# Altium schematic sheet 12V_Supply.SchDoc
size 297 x 209 mm; SheetNumber: 8; SheetTotal: 11
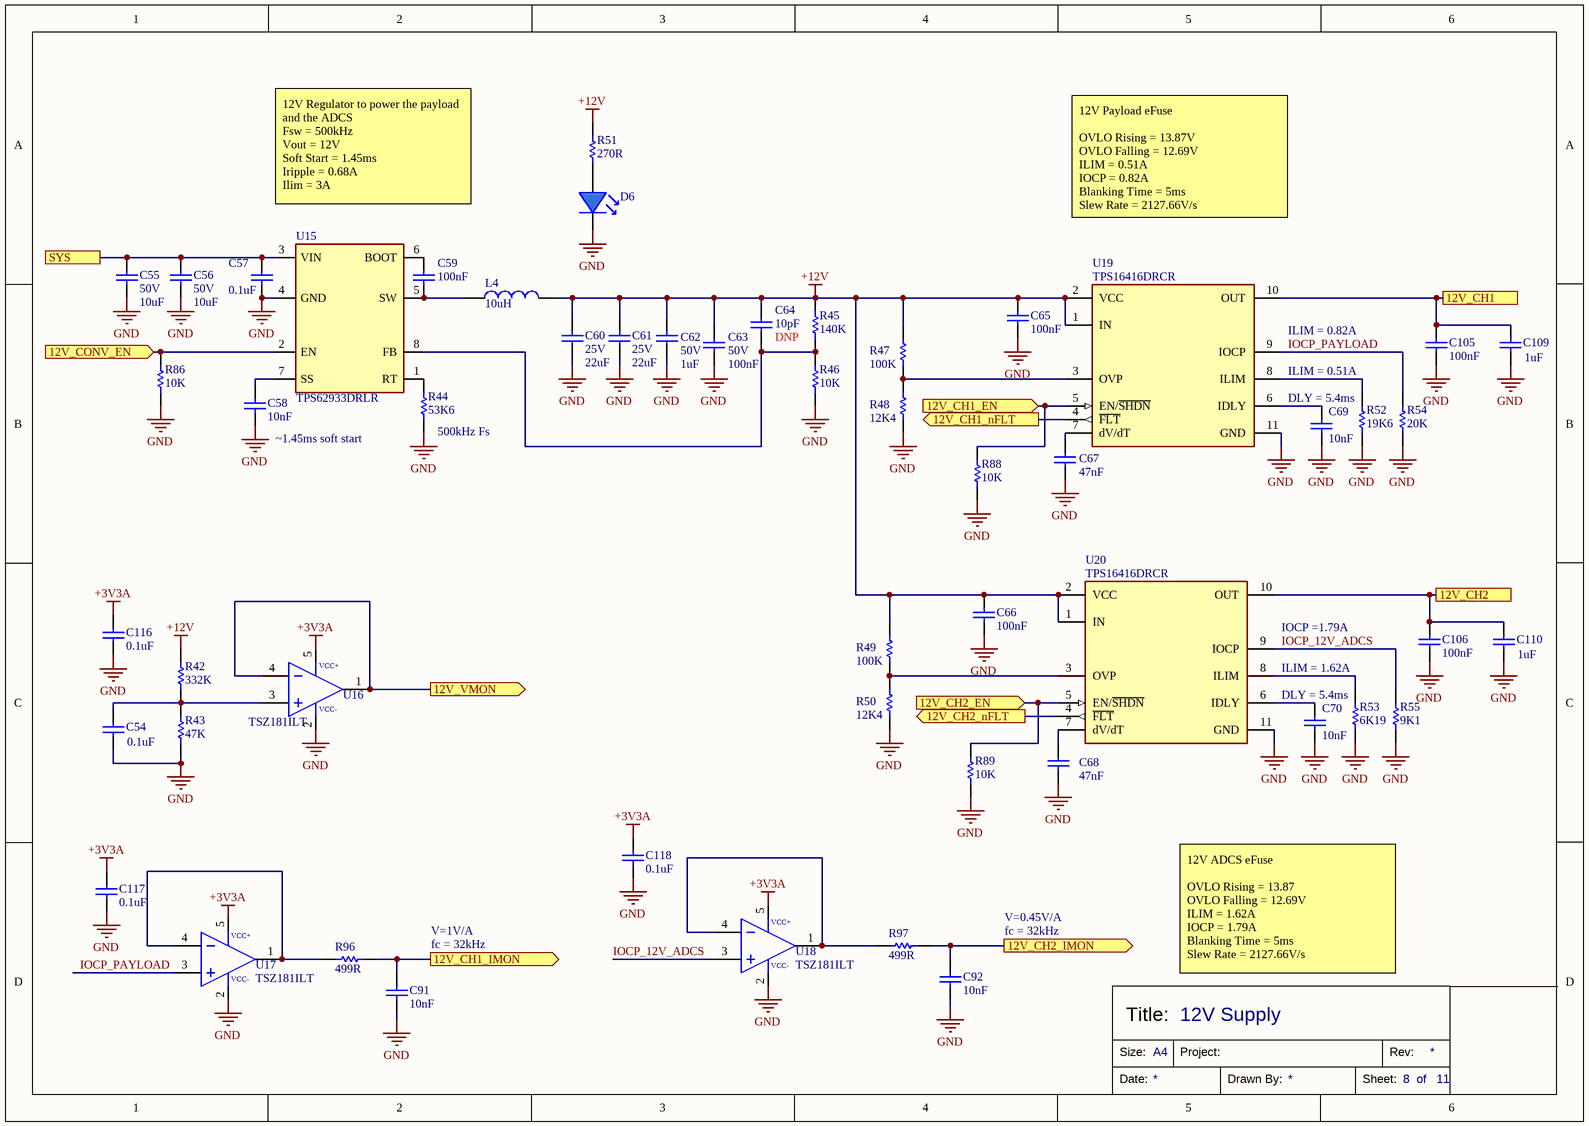
[diagram p0: 12V_Supply.SchDoc]

## Parts
C54  Capacitance: 0.1uF  [CAPC0805X060]  (hidden comment: CL21B104KACNNNC)
C55  Voltage Rating: 50V  Capacitance: 10uF  [CAPC1210X090]  (hidden comment: CL32B106KBJNNNE)
C56  Voltage Rating: 50V  Capacitance: 10uF  [CAPC1210X090]  (hidden comment: CL32B106KBJNNNE)
C57  Capacitance: 0.1uF  [CAPC0402X020]  (hidden comment: CL05B104KB5NNNC)
C58  Capacitance: 10nF  [CAPC0805X060]  (hidden comment: CL21B103KBANNNC)
C59  Capacitance: 100nF  [CAPC0603X040]  (hidden comment: C0603C104K5RACTU)
C60  Voltage Rating: 25V  Capacitance: 22uF  [CAPC1210X090]  (hidden comment: CL32B226KAJNNNE)
C61  Voltage Rating: 25V  Capacitance: 22uF  [CAPC1210X090]  (hidden comment: CL32B226KAJNNNE)
C62  Voltage Rating: 50V  Capacitance: 1uF  [CAPC0805X060]  (hidden comment: CL21B105KBFNNNE)
C63  Voltage Rating: 50V  Capacitance: 100nF  [CAPC0603X040]  (hidden comment: C0603C104K5RACTU)
C64  Capacitance: 10pF  [CAPC0603X040]  (hidden comment: C0603C104K5RACTU)
C65  Capacitance: 100nF  [CAPC0603X040]  (hidden comment: C0603C104K5RACTU)
C66  Capacitance: 100nF  [CAPC0603X040]  (hidden comment: C0603C104K5RACTU)
C67  Capacitance: 47nF  [CAPC0805X060]  (hidden comment: CL21B473KBCNNNC)
C68  Capacitance: 47nF  [CAPC0805X060]  (hidden comment: CL21B473KBCNNNC)
C69  Capacitance: 10nF  [CAPC0805X060]  (hidden comment: CL21B103KBANNNC)
C70  Capacitance: 10nF  [CAPC0805X060]  (hidden comment: CL21B103KBANNNC)
C91  Capacitance: 10nF  [CAPC0805X060]  (hidden comment: CL21B103KBANNNC)
C92  Capacitance: 10nF  [CAPC0805X060]  (hidden comment: CL21B103KBANNNC)
C105  Capacitance: 100nF  [CAPC0603X040]  (hidden comment: C0603C104K5RACTU)
C106  Capacitance: 100nF  [CAPC0603X040]  (hidden comment: C0603C104K5RACTU)
C109  Capacitance: 1uF  [CAPC0805X060]  (hidden comment: CL21B105KAFNNNE)
C110  Capacitance: 1uF  [CAPC0805X060]  (hidden comment: CL21B105KAFNNNE)
C116  Capacitance: 0.1uF  [CAPC0603X040]  (hidden comment: C0603C104K5RACTU)
C117  Capacitance: 0.1uF  [CAPC0603X040]  (hidden comment: C0603C104K5RACTU)
C118  Capacitance: 0.1uF  [CAPC0603X040]  (hidden comment: C0603C104K5RACTU)
D6  LSM0805463V  [LEDB_0805]  (value not drawn)
L4  Inductance: 10uH  [1274AS-H-100M=P3]  (hidden comment: 1274AS-H-100M=P3)
R42  Resistance: 332K  [RESC0805]  (hidden comment: RMCF0805FT332K)
R43  Resistance: 47K  [RESC0805]  (hidden comment: RMCF0805FT47K0)
R44  Resistance: 53K6  [RESC0805]  (hidden comment: RMCF0805FT53K6)
R45  Resistance: 140K  [RESC0603]  (hidden comment: RMCF0603FT140K)
R46  Resistance: 10K  [RESC0603]  (hidden comment: RMCF0603FT10K0)
R47  Resistance: 100K  [RESC0805]  (hidden comment: RMCF0805FG100K)
R48  Resistance: 12K4  [RESC0805]  (hidden comment: RMCF0805FT12K4)
R49  Resistance: 100K  [RESC0805]  (hidden comment: RMCF0805FG100K)
R50  Resistance: 12K4  [RESC0805]  (hidden comment: RMCF0805FT12K4)
R51  Resistance: 270R  [RESC0805]  (hidden comment: RMCF0805FT270R)
R52  Resistance: 19K6  [RESC0805]  (hidden comment: RMCF0805FT19K6)
R53  Resistance: 6K19  [RESC0805]  (hidden comment: RMCF0805FT6K19)
R54  Resistance: 20K  [RESC0805]  (hidden comment: RMCF0805FT20K0)
R55  Resistance: 9K1  [RESC0805]  (hidden comment: RMCF0805FT9K10)
R86  Resistance: 10K  [RESC0805]  (hidden comment: RMCF0805FT10K0)
R88  Resistance: 10K  [RESC0805]  (hidden comment: RMCF0805FT10K0)
R89  Resistance: 10K  [RESC0805]  (hidden comment: RMCF0805FT10K0)
R96  Resistance: 499R  [RESC0805]  (hidden comment: RMCF0805FT499R)
R97  Resistance: 499R  [RESC0805]  (hidden comment: RMCF0805FT499R)
U15  TPS62933DRLR  [SOT-583]
U16  TSZ181ILT  [SOT23-5 IC]
U17  TSZ181ILT  [SOT23-5 IC]
U18  TSZ181ILT  [SOT23-5 IC]
U19  Part Number: TPS16416DRCR  [TPS1641]  (hidden comment: TPS16410DRCR)
U20  Part Number: TPS16416DRCR  [TPS1641]  (hidden comment: TPS16410DRCR)

## Ports
12V_CH1 (see PDM[6C]), 12V_CH1_EN (in, see PDM[5C], Controller[3B]), 12V_CH1_IMON (out, see PDM[5D], Controller[1C]), 12V_CH1_nFLT (out, see PDM[5C], Controller[3B]), 12V_CH2 (see PDM[6C]), 12V_CH2_EN (in, see PDM[5C], Controller[3B]), 12V_CH2_IMON (out, see PDM[5D], Controller[1B]), 12V_CH2_nFLT (out, see PDM[5C], Controller[3B]), 12V_CONV_EN (in, see PDM[5C], Controller[3B]), 12V_VMON (out, see PDM[5C], Controller[1B]), SYS (see PDM[5C], 3V3_Supply[1B], 5V_Supply[1A], 6V_Supply[1B], PC104[4C], PC104[5C])

## Nets
+3V3A: C116.2 C117.2 C118.2 U16.5(VCC+) U17.5(VCC+) U18.5(VCC+)
+12V: C60.2 C61.2 C62.2 C63.2 C64.2 C65.2 C66.2 L4.2 R42.2 R45.2 R47.2 R49.2 R51.2 U19.1(IN) U19.2(VCC) U20.1(IN) U20.2(VCC)
GND: C54.1 C55.1 C56.1 C57.1 C58.1 C60.1 C61.1 C62.1 C63.1 C65.1 C66.1 C67.1 C68.1 C69.1 C70.1 C91.1 C92.1 C105.1 C106.1 C109.1 C110.1 C116.1 C117.1 C118.1 D6.K R43.1 R44.1 R46.1 R48.1 R50.1 R52.1 R53.1 R54.1 R55.1 R86.1 R88.1 R89.1 U15.4(GND) U16.2(VCC-) U17.2(VCC-) U18.2(VCC-) U19.11(GND) U20.11(GND)
12V_CH1: C105.2 C109.2 U19.10(OUT) ; port 12V_CH1
12V_CH1_EN: R88.2 U19.5(EN/~{SHDN}) ; port 12V_CH1_EN
12V_CH1_IMON: C91.2 R96.2 ; port 12V_CH1_IMON
12V_CH1_nFLT: U19.4(~{FLT}) ; port 12V_CH1_nFLT
12V_CH2: C106.2 C110.2 U20.10(OUT) ; port 12V_CH2
12V_CH2_EN: R89.2 U20.5(EN/~{SHDN}) ; port 12V_CH2_EN
12V_CH2_IMON: C92.2 R97.2 ; port 12V_CH2_IMON
12V_CH2_nFLT: U20.4(~{FLT}) ; port 12V_CH2_nFLT
12V_CONV_EN: R86.2 U15.2(EN) ; port 12V_CONV_EN
12V_VMON: U16.1(OUT) U16.4(IN-) ; port 12V_VMON
IOCP_12V_ADCS: R55.2 U18.3(IN+) U20.9(IOCP)
IOCP_PAYLOAD: R54.2 U17.3(IN+) U19.9(IOCP)
SYS: C55.2 C56.2 C57.2 U15.3(VIN) ; port SYS
NetC54_2: C54.2 R42.1 R43.2 U16.3(IN+)
NetC58_2: C58.2 U15.7(SS)
NetC59_1: C59.1 L4.1 U15.5(SW)
NetC59_2: C59.2 U15.6(BOOT)
NetC64_1: C64.1 R45.1 R46.2 U15.8(FB)
NetC67_2: C67.2 U19.7(dV/dT)
NetC68_2: C68.2 U20.7(dV/dT)
NetC69_2: C69.2 U19.6(IDLY)
NetC70_2: C70.2 U20.6(IDLY)
NetD6_A: D6.A R51.1
NetR44_2: R44.2 U15.1(RT)
NetR47_1: R47.1 R48.2 U19.3(OVP)
NetR49_1: R49.1 R50.2 U20.3(OVP)
NetR52_2: R52.2 U19.8(ILIM)
NetR53_2: R53.2 U20.8(ILIM)
NetR96_1: R96.1 U17.1(OUT) U17.4(IN-)
NetR97_1: R97.1 U18.1(OUT) U18.4(IN-)

## Notes on the sheet
- 12V Regulator to power the payload and the ADCS
  Fsw = 500kHz
  Vout = 12V
  Soft Start = 1.45ms
  Iripple = 0.68A
  Ilim = 3A
- 12V Payload eFuse
  OVLO Rising = 13.87V
  OVLO Falling = 12.69V
  ILIM = 0.51A
  IOCP = 0.82A
  Blanking Time = 5ms
  Slew Rate = 2127.66V/s
- DNP
- (near U19) ILIM = 0.82A
- DLY = 5.4ms
- ILIM = 0.51A
- ~1.45ms soft start
- (near R44) 500kHz Fs
- ILIM = 1.62A
- (near U20) IOCP =1.79A
- V=1V/A
- V=0.45V/A
- fc = 32kHz
- 12V ADCS eFuse
  OVLO Rising = 13.87
  OVLO Falling = 12.69V
  ILIM = 1.62A
  IOCP = 1.79A
  Blanking Time = 5ms
  Slew Rate = 2127.66V/s
- 12V Supply
- Size:
- Title:
- A4
- Project:
- Rev:
- Date:
- Drawn By:
- Sheet:
- of

## Library data of the parts
C54 = CL21B104KACNNNC: 0.1uF ±10% 25V Ceramic Capacitor X7R 0805 (2012 Metric); Part Number: CL21B104KACNNNC; Distributor Part Number: 1276-1099-1-ND; Tolerance: 10%; Case Code: 0805; Distributor: Digikey; Voltage Rating: 25V
C55 C56 = CL32B106KBJNNNE: 10 µF ±10% 50V Ceramic Capacitor X7R 1210 (3225 Metric); Manufacturer Part Number: CL32B106KBJNNNE; Distributor Part Number: 1276-3387-1-ND; Tolerance: 10%; Case Code: 1210; Distributor: Digikey
C57 = CL05B104KB5NNNC: 0.1 µF ±10% 50V Ceramic Capacitor X7R 0402 (1005 Metric); Part Number: CL05B104KB5NNNC; Tolerance: 10%; Distributor Part Number: 1276-CL05B104KB5NNNCCT-ND; Case Code: 0402; Distributor: Digikey; Voltage Rating: 50V
C58 C69 C70 C91 C92 = CL21B103KBANNNC: 10nF ±10% 50V Ceramic Capacitor X7R 0805 (2012 Metric); Voltage Rating: 25V; Part Number: CL21B103KBANNNC; Distributor Part Number: 1276-1015-1-ND; Tolerance: 10%; Case Code: 0805; Distributor: Digikey
C59 C63 C65 C66 C105 C106 C116-C118 = C0603C104K5RACTU: 0.1 µF ±10% 50V Ceramic Capacitor X7R 0603 (1608 Metric); Distributor Part Number: 399-C0603C104K5RACTUCT-ND; Tolerance: 10%; Case Code: 0603; Distributor: Digikey
  C59: Manufacturer Part Number: C0603C104K5RACTU; Voltage Rating: 50V
  C63: Part Number: C0603C104K5RACTU
  C65 C66 C105 C106 C116-C118: Part Number: C0603C104K5RACTU; Voltage Rating: 50V
C60 C61 = CL32B226KAJNNNE: 22 µF ±10% 25V Ceramic Capacitor X7R 1210 (3225 Metric); Part Number: CL32B226KAJNNNE; Distributor Part Number: 1276-3392-1-ND; Tolerance: 10%; Case Code: 1210; Distributor: Digikey
C62 = CL21B105KBFNNNE: 1uF 50V X7R ±10% 0805 Multilayer Ceramic Capacitors MLCC - SMD/SMT ROHS; Part Number: CL21B105KBFNNNE; Distributor Part Number: 1276-1029-1-ND; Tolerance: 10%; Case Code: 0805; Distributor: Digikey
C64 = C0603C100J5GACTU: 10 pF ±5% 50V Ceramic Capacitor C0G, NP0 0603 (1608 Metric); Tolerance: 10%; Part Number: C0603C100J5GACTU; Distributor Part Number: 399-C0603C100J5GACTUCT-ND; Case Code: 0603; Distributor: Digikey; Voltage Rating: 50V
C67 C68 = CL21B473KBCNNNC: 0.047 µF ±10% 50V Ceramic Capacitor X7R 0805 (2012 Metric); Voltage Rating: 25V; Part Number: CL21B473KBCNNNC; Distributor Part Number: 1276-1250-1-ND; Tolerance: 10%; Case Code: 0805; Distributor: Digikey
C109 C110 = CL21B105KAFNNNE: 1uF ±10% 25V Ceramic Capacitor X7R 0805 (2012 Metric); Part Number: CL21B105KAFNNNE; Distributor Part Number: 1276-1066-1-ND; Tolerance: 10%; Case Code: 0805; Distributor: Digikey; Voltage Rating: 25V
D6 = LEDB0805: Blue 469nm LED Indication - Discrete 3V 0805 (2012 Metric); Manufacturer Part Number: LSM0805463V; Distributor Part Number: 28-LSM0805463VCT-ND; Colour: Blue; Operating Temperature: *; Voltage - Forward: 3V; Distributor: Digikey
L4 = 1274AS-H-100M=P3: Inductor 10 µH , 4.4 A 30.4mOhm Max Shielded Drum Core; Current Rating: 4.4A; Saturation Current: 6.2A; Part Number: 1274AS-H-100M=P3; Distributor Part Number: 490-10846-1-ND; Distributor: Digikey; DCR: 30.4mOhm
R42 = RMCF0805FT332K: 332 kOhms ±1% 0.125W, 1/8W Chip Resistor 0805 (2012 Metric) Automotive AEC-Q200 Thick Film; Part Number: RMCF0805FT332K; Tolerance: 1%; Distributor Part Number: RMCF0805FT332KCT-ND; Distributor: Digikey; Case Code: 0805
R43 = RMCF0805FT47K0: 47 kOhms ±1% 0.125W, 1/8W Chip Resistor 0805 (2012 Metric) Automotive AEC-Q200 Thick Film; Part Number: RMCF0805FT47K0; Tolerance: 1%; Distributor Part Number: RMCF0805FT47K0CT-ND; Distributor: Digikey; Case Code: 0805
R44 = RMCF0805FT53K6: 53.6 kOhms ±1% 0.125W, 1/8W Chip Resistor 0805 (2012 Metric) Automotive AEC-Q200 Thick Film; Part Number: RMCF0805FT53K6; Tolerance: 1%; Distributor Part Number: RMCF0805FT53K6CT-ND; Distributor: Digikey; Case Code: 0805
R45 = RMCF0603FT140K: 140 kOhms ±1% 0.1W, 1/10W Chip Resistor 0603 (1608 Metric) Automotive AEC-Q200 Thick Film; Part Number: RMCF0603FT100K; Tolerance: 1%; Distributor: Digikey; Distributor Part Number: RMCF0603FT140KCT-ND; Case Code: 0603
R46 = RMCF0603FT10K0: 10 kOhms ±1% 0.1W, 1/10W Chip Resistor 0603 (1608 Metric) Automotive AEC-Q200 Thick Film; Tolerance: 1%; Distributor Part Number: RMCF0603FT10K0CT-ND; Distributor: Digikey; Case Code: 0603; Part Number: RMCF0603FT10K0
R47 R49 = RMCF0805FG100K: 100 kOhms ±1% 0.125W, 1/8W Chip Resistor 0805 (2012 Metric) Automotive AEC-Q200 Thick Film; Part Number: RMCF0805FG100K; Tolerance: 1%; Distributor Part Number: RMCF0805FG100KCT-ND; Distributor: Digikey; Case Code: 0805
R48 R50 = RMCF0805FT12K4: 12.4 kOhms ±1% 0.125W, 1/8W Chip Resistor 0805 (2012 Metric) Automotive AEC-Q200 Thick Film; Part Number: RMCF0805FT12K4; Tolerance: 1%; Distributor Part Number: RMCF0805FT12K4CT-ND; Distributor: Digikey; Case Code: 0805
R51 = RMCF0805FT270R: 270 Ohms ±1% 0.125W, 1/8W Chip Resistor 0805 (2012 Metric) Automotive AEC-Q200 Thick Film; Part Number: RMCF0805FT270R; Tolerance: 1%; Distributor Part Number: RMCF0805FT270RCT-ND; Distributor: Digikey; Case Code: 0805
R52 = RMCF0805FT19K6: 19.6 kOhms ±1% 0.125W, 1/8W Chip Resistor 0805 (2012 Metric) Automotive AEC-Q200 Thick Film; Part Number: RMCF0805FT19K6; Tolerance: 1%; Distributor Part Number: RMCF0805FT19K6CT-ND; Distributor: Digikey; Case Code: 0805
R53 = RMCF0805FT6K19: 6.19 kOhms ±1% 0.125W, 1/8W Chip Resistor 0805 (2012 Metric) Automotive AEC-Q200 Thick Film; Part Number: RMCF0805FT6K19; Tolerance: 1%; Distributor Part Number: RMCF0805FT6K19CT-ND; Distributor: Digikey; Case Code: 0805
R54 = RMCF0805FT20K0: 20 kOhms ±1% 0.125W, 1/8W Chip Resistor 0805 (2012 Metric) Automotive AEC-Q200 Thick Film; Part Number: RMCF0805FT20K0; Tolerance: 1%; Distributor Part Number: RMCF0805FT20K0CT-ND; Distributor: Digikey; Case Code: 0805
R55 = RMCF0805FT9K10: 9.1 kOhms ±1% 0.125W, 1/8W Chip Resistor 0805 (2012 Metric) Automotive AEC-Q200 Thick Film; Part Number: RMCF0805FT9K10; Tolerance: 1%; Distributor Part Number: 738-RMCF0805FT9K10CT-ND; Distributor: Digikey; Case Code: 0805
R86 R88 R89 = RMCF0805FT10K0: 10 kOhms ±1% 0.125W, 1/8W Chip Resistor 0805 (2012 Metric) Automotive AEC-Q200 Thick Film; Part Number: RMCF0805FT10K0; Tolerance: 1%; Distributor Part Number: RMCF0805FT10K0CT-ND; Distributor: Digikey; Case Code: 0805
R96 R97 = RMCF0805FT499R: 499 Ohms ±1% 0.125W, 1/8W Chip Resistor 0805 (2012 Metric) Automotive AEC-Q200 Thick Film; Part Number: RMCF0805FT499R; Tolerance: 1%; Distributor Part Number: RMCF0805FT499RCT-ND; Distributor: Digikey; Case Code: 0805
U15 = TPS62933DRLR: Buck Switching Regulator IC Positive Adjustable 0.8V 1 Output 3A SOT-583; Voltage - Input (Min): 3.8V; Voltage - Input (Max): 30V; Voltage - Output (Max): 22V; Part Number: TPS62933DRLR; Distributor Part Number: 296-TPS62933DRLRCT-ND; Distributor: Digikey; Operating Temperature: -40°C ~ 150°C (TJ); Current Output: 3A; Voltage - Output (Min): 0.8V
U16-U18 = TSZ181ILT: Operational Amplifier, General Purpose, 2.2V~5.5V; Voltage Supply (Min): 2.2V; Voltage Supply (Max): 5.5V; Slew Rate: 4.7V/us; Gain Bandwidth Product: 3MHz; Part Number: TSZ181ILT; Distributor: Digikey; Distributor Part Number: 497-18084-1-ND; Operating Temperature: -40°C ~ 125°C
U19 U20 = TPS16410DRCR: 2.7-V to 40-V 152-mΩ 1.8-A eFuse with output power limiting; Qualification: None; Current - Output: 1.8A; Voltage - Input: 2.7V ~ 40V; Distributor Part Number: 296-TPS16410DRCRCT-ND; Package: 10-VSON (3x3); Distributor: Digikey; Operating Temperature: -40C ~ 125C